# EAGLE design Sequencer1 (EAGLE 9.6.2)
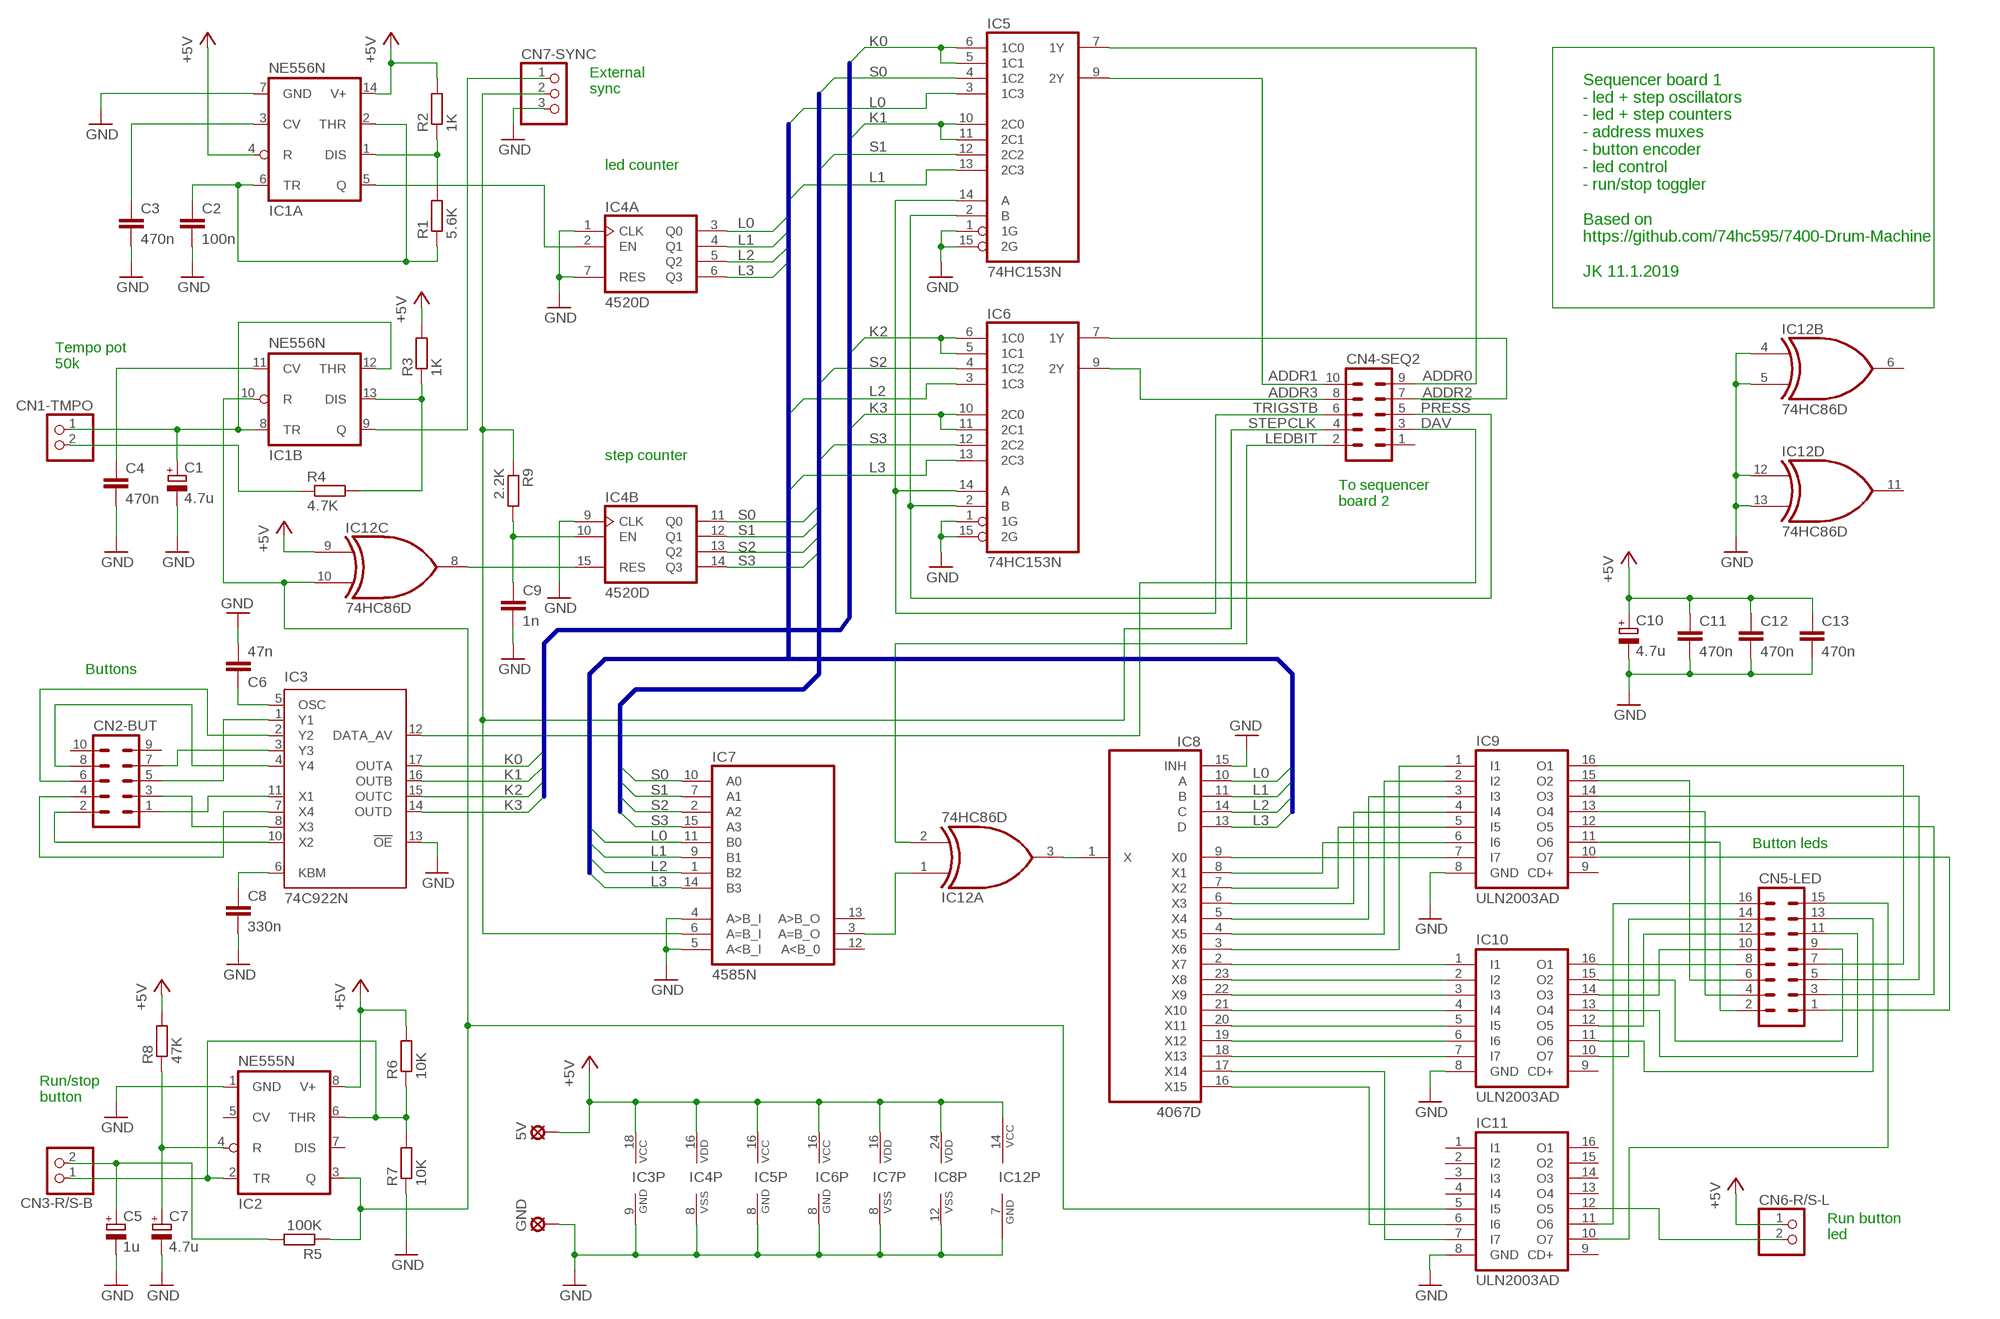
[diagram p0: schematic, sheet 1]

## Parts
5V  LSP10  [LSP10]
C1  4.7u  CPOL-EUSMCA  [SMC_A]
C2  100n  C-EUC0805  [C0805]
C3  470n  C-EUC0603  [C0603]
C4  470n  C-EUC0603  [C0603]
C5  1u  CPOL-EUSMCA  [SMC_A]
C6  47n  C-EUC0805  [C0805]
C7  4.7u  CPOL-EUSMCA  [SMC_A]
C8  330n  C-EUC0805  [C0805]
C9  1n  C-EUC0805  [C0805]
C10  4.7u  CPOL-EUSMCA  [SMC_A]
C11  470n  C-EUC0603  [C0603]
C12  470n  C-EUC0603  [C0603]
C13  470n  C-EUC0603  [C0603]
CN1-TMPO  PINHD-1X2  [1X02]
CN2-BUT  MA05-2  [MA05-2]
CN3-R/S-B  PINHD-1X2  [1X02]
CN4-SEQ2  MA05-2  [MA05-2]
CN5-LED  MA08-2  [MA08-2]
CN6-R/S-L  PINHD-1X2  [1X02]
CN7-SYNC  PINHD-1X3  [1X03]
GND  LSP10  [LSP10]
IC1  NE556N  [DIL14]
IC2  NE555N  [DIL08]
IC3  74C922N  [DIL18]
IC4  4520D  [SO16]
IC5  74HC153N  74AC153N  [DIL16]
IC6  74HC153N  74AC153N  [DIL16]
IC7  4585N  [DIL16]
IC8  4067D  [SO24W]
IC9  ULN2003AD  [SO16]
IC10  ULN2003AD  [SO16]
IC11  ULN2003AD  [SO16]
IC12  74HC86D  74LS86D  [SO14]
R1  5.6K  R-EU_R0805  [R0805]
R2  1K  R-EU_R0805  [R0805]
R3  1K  R-EU_R0805  [R0805]
R4  4.7K  R-EU_R0805  [R0805]
R5  100K  R-EU_R0805  [R0805]
R6  10K  R-EU_R0805  [R0805]
R7  10K  R-EU_R0805  [R0805]
R8  47K  R-EU_R0805  [R0805]
R9  2.2K  R-EU_R0805  [R0805]

## Nets
!PRESS: CN4-SEQ2.5 IC5.2(B) IC6.2(B)
!RUN: IC4.15(B:RES) IC12.8(C:O)
+5V: 5V.MP C10.+ C11.1 C12.1 C13.1 CN6-R/S-L.1 IC1.4(A:R) IC1.14(A:V+) IC2.8(V+) IC3.18(VCC) IC4.16(P:VDD) IC5.16(VCC) IC6.16(VCC) IC7.16(VDD) IC8.24(VDD) IC12.9(C:I0) IC12.14(P:VCC) R2.2 R3.2 R6.2 R8.2
ADDR0: CN4-SEQ2.9 IC5.7(1Y)
ADDR1: CN4-SEQ2.10 IC5.9(2Y)
ADDR2: CN4-SEQ2.7 IC6.7(1Y)
ADDR3: CN4-SEQ2.8 IC6.9(2Y)
DAV: CN4-SEQ2.3 IC3.12(DATA_AV)
GND: C1.- C2.2 C3.2 C4.2 C5.- C6.2 C7.- C8.2 C9.2 C10.- C11.2 C12.2 C13.2 CN7-SYNC.3 GND.MP IC1.7(A:GND) IC2.1(GND) IC3.9(GND) IC3.13(!OE) IC4.1(A:CLK) IC4.7(A:RES) IC4.8(P:VSS) IC4.9(B:CLK) IC5.1(1G) IC5.8(GND) IC5.15(2G) IC6.1(1G) IC6.8(GND) IC6.15(2G) IC7.4(A>B_I) IC7.5(A<B_I) IC7.8(VSS) IC8.12(VSS) IC8.15(INH) IC9.8(GND) IC10.8(GND) IC11.8(GND) IC12.4(B:I0) IC12.5(B:I1) IC12.7(P:GND) IC12.12(D:I0) IC12.13(D:I1) R7.1
K0: IC3.17(OUTA) IC5.5(1C1) IC5.6(1C0)
K1: IC3.16(OUTB) IC5.10(2C0) IC5.11(2C1)
K2: IC3.15(OUTC) IC6.5(1C1) IC6.6(1C0)
K3: IC3.14(OUTD) IC6.10(2C0) IC6.11(2C1)
L0: IC4.3(A:Q0) IC5.3(1C3) IC7.11(B0) IC8.10(A)
L1: IC4.4(A:Q1) IC5.13(2C3) IC7.9(B1) IC8.11(B)
L2: IC4.5(A:Q2) IC6.3(1C3) IC7.1(B2) IC8.14(C)
L3: IC4.6(A:Q3) IC6.13(2C3) IC7.14(B3) IC8.13(D)
LED0: CN5-LED.1 IC9.10(O7)
LED1: CN5-LED.2 IC9.11(O6)
LED2: CN5-LED.3 IC9.12(O5)
LED3: CN5-LED.4 IC9.13(O4)
LED4: CN5-LED.5 IC9.14(O3)
LED5: CN5-LED.6 IC9.15(O2)
LED6: CN5-LED.7 IC9.16(O1)
LED7: CN5-LED.8 IC10.16(O1)
LED8: CN5-LED.9 IC10.15(O2)
LED9: CN5-LED.10 IC10.14(O3)
LED10: CN5-LED.11 IC10.13(O4)
LED11: CN5-LED.12 IC10.12(O5)
LED12: CN5-LED.13 IC10.11(O6)
LED13: CN5-LED.14 IC10.10(O7)
LED14: CN5-LED.15 IC11.10(O7)
LED15: CN5-LED.16 IC11.11(O6)
LEDBIT: CN4-SEQ2.2 IC12.2(A:I1)
LEDCLK: IC1.5(A:Q) IC4.2(A:EN)
N$1: C3.1 IC1.3(A:CV)
N$2: C2.1 IC1.2(A:THR) IC1.6(A:TR) R1.1
N$3: C1.+ CN1-TMPO.1 IC1.8(B:TR) IC1.12(B:THR)
N$4: IC1.1(A:DIS) R1.2 R2.1
N$5: C4.1 IC1.11(B:CV)
N$6: CN1-TMPO.2 R4.1
N$7: IC1.13(B:DIS) R3.1 R4.2
N$8: CN3-R/S-B.1 IC2.2(TR) IC2.6(THR) R6.1 R7.2
N$9: C8.1 IC3.6(KBM)
N$10: C6.1 IC3.5(OSC)
N$11: C5.+ CN3-R/S-B.2 R5.2
N$12: IC8.9(X0) IC9.7(I7)
N$14: IC8.7(X2) IC9.5(I5)
N$15: C7.+ IC2.4(R) R8.1
N$16: IC8.6(X3) IC9.4(I4)
N$17: IC8.5(X4) IC9.3(I3)
N$18: IC8.4(X5) IC9.2(I2)
N$19: C9.1 IC4.10(B:EN) R9.2
N$20: IC8.3(X6) IC9.1(I1)
N$21: IC8.2(X7) IC10.1(I1)
N$22: IC8.23(X8) IC10.2(I2)
N$23: IC8.22(X9) IC10.3(I3)
N$24: IC8.21(X10) IC10.4(I4)
N$25: IC8.20(X11) IC10.5(I5)
N$26: IC8.19(X12) IC10.6(I6)
N$27: IC8.18(X13) IC10.7(I7)
N$28: IC8.17(X14) IC11.7(I7)
N$29: IC8.16(X15) IC11.6(I6)
N$30: IC8.1(X) IC12.3(A:O)
N$31: IC7.3(A=B_O) IC12.1(A:I0)
N$32: IC8.8(X1) IC9.6(I6)
RUN: IC1.10(B:R) IC2.3(Q) IC11.5(I5) IC12.10(C:I1) R5.1
RUNLED: CN6-R/S-L.2 IC11.12(O5)
S0: IC4.11(B:Q0) IC5.4(1C2) IC7.10(A0)
S1: IC4.12(B:Q1) IC5.12(2C2) IC7.7(A1)
S2: IC4.13(B:Q2) IC6.4(1C2) IC7.2(A2)
S3: IC4.14(B:Q3) IC6.12(2C2) IC7.15(A3)
STEPCLK: CN4-SEQ2.4 CN7-SYNC.2 IC7.6(A=B_I) R9.1
STEPCLK_OUT: CN7-SYNC.1 IC1.9(B:Q)
TRIGSTB: CN4-SEQ2.6 IC5.14(A) IC6.14(A)
X1: CN2-BUT.1 IC3.11(X1)
X2: CN2-BUT.2 IC3.10(X2)
X3: CN2-BUT.3 IC3.8(X3)
X4: CN2-BUT.4 IC3.7(X4)
Y1: CN2-BUT.5 IC3.1(Y1)
Y2: CN2-BUT.6 IC3.2(Y2)
Y3: CN2-BUT.7 IC3.3(Y3)
Y4: CN2-BUT.8 IC3.4(Y4)
Unconnected: CN2-BUT.9 CN2-BUT.10 CN4-SEQ2.1 IC2.5(CV) IC2.7(DIS) IC7.12(A<B_0) IC7.13(A>B_O) IC9.9(CD+) IC10.9(CD+) IC11.1(I1) IC11.2(I2) IC11.3(I3) IC11.4(I4) IC11.9(CD+) IC11.13(O4) IC11.14(O3) IC11.15(O2) IC11.16(O1) IC12.6(B:O) IC12.11(D:O)

## Buses
B$1
B$2
B$3

## Notes on the sheet
- External
  sync
- led counter
- Sequencer board 1
  - led + step oscillators
  - led + step counters
  - address muxes
  - button encoder
  - led control
  - run/stop toggler
  
  Based on
  https://github.com/74hc595/7400-Drum-Machine
  
  JK 11.1.2019
- Tempo pot
  50k
- step counter
- To sequencer
  board 2
- Buttons
- Button leds
- Run/stop
  button
- Run button
  led

## Library data of the parts
5V GND = solpad:LSP10: SOLDER PAD drill 1.0 mm, distributor Buerklin, 12H555
C1 C5 C7 C10 = rcl:CPOL-EU: POLARIZED CAPACITOR, European symbol
C2-C4 C6 C8 C9 C11-C13 = rcl:C-EU: CAPACITOR, European symbol
CN1-TMPO CN3-R/S-B CN6-R/S-L = pinhead:PINHD-1X2: PIN HEADER
CN2-BUT CN4-SEQ2 = con-lstb:MA05-2: PIN HEADER; OC_FARNELL: unknown; OC_NEWARK: unknown
CN5-LED = con-lstb:MA08-2: PIN HEADER; OC_FARNELL: unknown; OC_NEWARK: unknown
CN7-SYNC = pinhead:PINHD-1X3: PIN HEADER
IC1 = linear:*556: Dual TIMER
IC2 = linear:*555: TIMER
IC3 = 74xx-eu:74C922: 16-Key Encoder Source: http://www.national.com/ds/MM/MM54C922.pdf#page=1
IC4 = 45xx:4520: Dual binary up COUNTER
IC5 IC6 = 74xx-eu:74*153: Dual 4-line to 1-line data SELECTOR/MULTIPLEXER
IC7 = 45xx:4585: 4-bit COMPARATOR (MC14585BCP)
IC8 = 40xx:4067: 16-channel ANALOG MULTIPLEXER
IC9-IC11 = uln-udn:ULN2003A: DRIVER ARRAY
IC12 = 74xx-us:74*86: Quad 2-input EXCLUSIV-OR (XOR) gate
R1-R9 = rcl:R-EU_: RESISTOR, European symbol

## Board
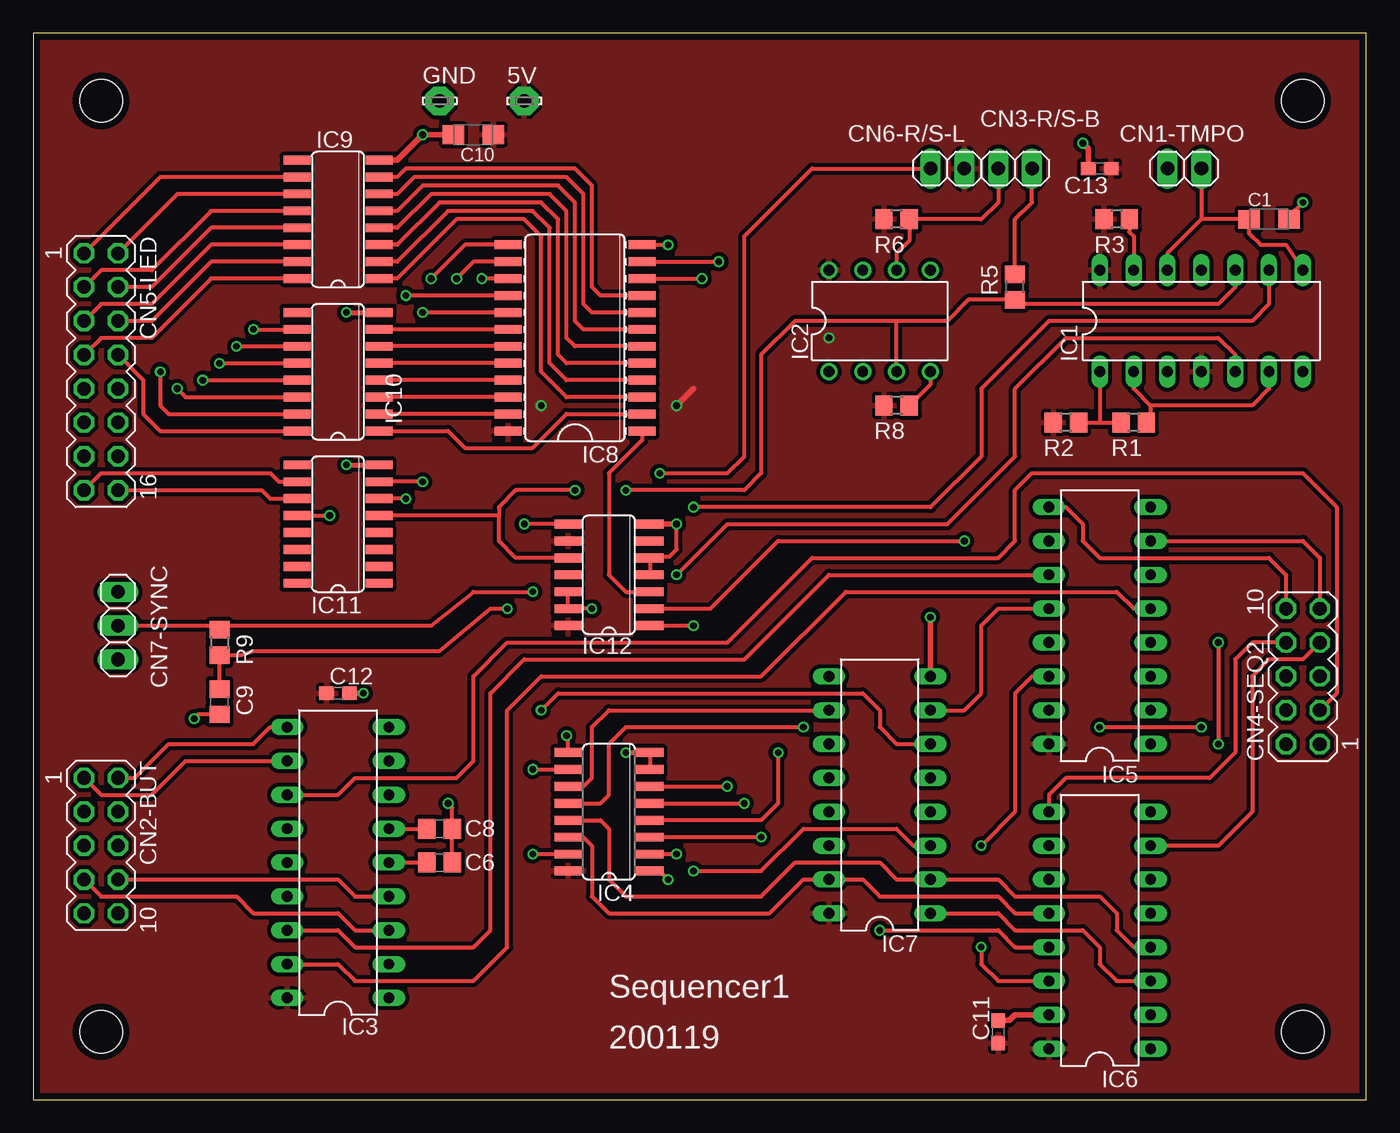
[diagram p1: board, top side]
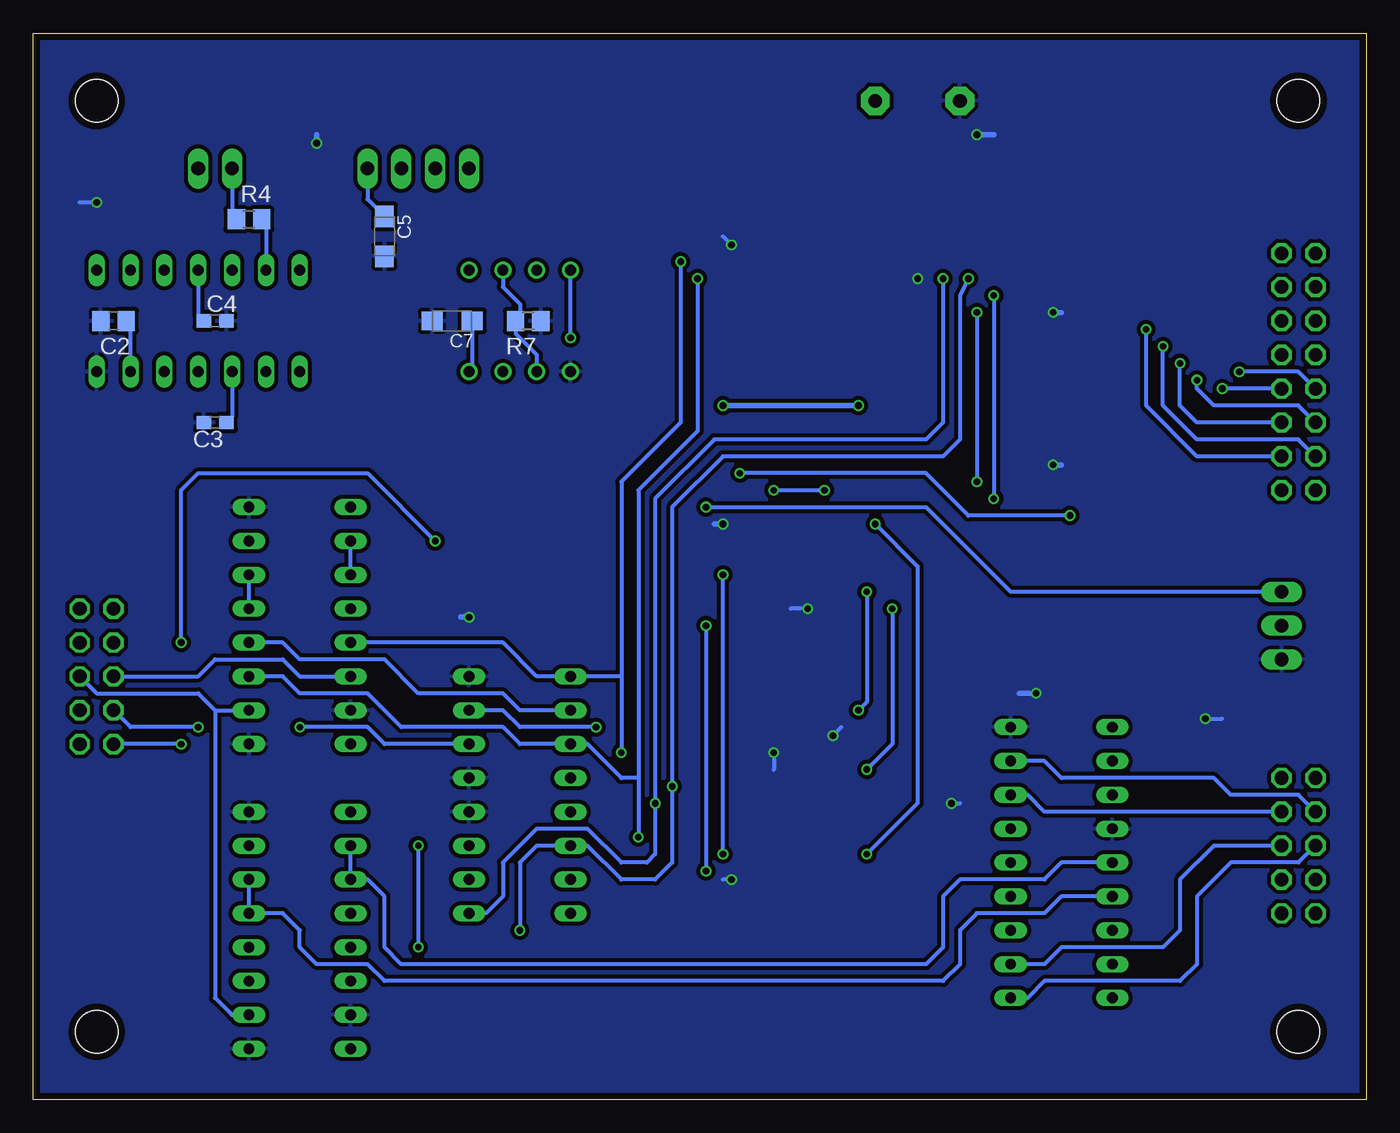
[diagram p2: board, bottom side, seen from below]

Size 100 x 80 mm. Coordinates in mm from the lower left corner, seen from the top.
Outline: 0,0 100,0 100,80 0,80 0,0
Copper layers (1*16): Top 0.035mm / dielectric 1.6mm / Bottom 0.035mm
Design rules "Elecrow_2-layer_PCB_eagle_rule": minimum track width 6mil, minimum drill 12mil, track to track 6mil, track to pad 6mil, pad to pad 6mil, via to via 8mil, smd to smd 0mil, copper to edge 20mil, drill to drill 10mil, minimum pad ring 6mil, minimum via ring 6mil, stop-mask expansion 0mil, vias tented up to drill 100mil, thermal gap 10mil
Holes 3.2 mm at 5.08,5.08 95.25,5.08 5.08,74.93 95.25,74.93

### Footprints (pad centres in the part's own frame; a part is rotated, then mirrored left to right if it is on the bottom)
LSP10 = drill 1.016 pad 2.159 octagon: MP 0,0
SMC_A = smd 1.6 x 1.4: + -1.5,0; - 1.5,0
C0805 = smd 1.3 x 1.5: 1 -0.95,0; 2 0.95,0
C0603 = smd 1.1 x 1: 1 -0.85,0; 2 0.85,0
1X02 = drill 1.016 long: 1 -1.27,0; 2 1.27,0
MA05-2 = drill 1.016 octagon: 1 -5.08,-1.27; 2 -5.08,1.27; 3 -2.54,-1.27; 4 -2.54,1.27; 5 0,-1.27; 6 0,1.27; 7 2.54,-1.27; 8 2.54,1.27; 9 5.08,-1.27; 10 5.08,1.27
MA08-2 = drill 1.016 octagon: 1 -8.89,-1.27; 2 -8.89,1.27; 3 -6.35,-1.27; 4 -6.35,1.27; 5 -3.81,-1.27; 6 -3.81,1.27; 7 -1.27,-1.27; 8 -1.27,1.27; 9 1.27,-1.27; 10 1.27,1.27; 11 3.81,-1.27; 12 3.81,1.27; 13 6.35,-1.27; 14 6.35,1.27; 15 8.89,-1.27; 16 8.89,1.27
1X03 = drill 1.016 long: 1 -2.54,0; 2 0,0; 3 2.54,0
DIL14 = drill 0.813 long: 1 -7.62,-3.81; 2 -5.08,-3.81; 3 -2.54,-3.81; 4 0,-3.81; 5 2.54,-3.81; 6 5.08,-3.81; 7 7.62,-3.81; 8 7.62,3.81; 9 5.08,3.81; 10 2.54,3.81; 11 0,3.81; 12 -2.54,3.81; 13 -5.08,3.81; 14 -7.62,3.81
DIL08 = drill 0.813 pad 1.27: 1 -3.81,-3.81; 2 -1.27,-3.81; 3 1.27,-3.81; 4 3.81,-3.81; 5 3.81,3.81; 6 1.27,3.81; 7 -1.27,3.81; 8 -3.81,3.81
DIL18 = drill 0.813 long: 1 -10.16,-3.81; 2 -7.62,-3.81; 3 -5.08,-3.81; 4 -2.54,-3.81; 5 0,-3.81; 6 2.54,-3.81; 7 5.08,-3.81; 8 7.62,-3.81; 9 10.16,-3.81; 10 10.16,3.81; 11 7.62,3.81; 12 5.08,3.81; 13 2.54,3.81; 14 0,3.81; 15 -2.54,3.81; 16 -5.08,3.81; 17 -7.62,3.81; 18 -10.16,3.81
SO16 = smd 0.66 x 2.032: 1 -4.445,-3.073; 2 -3.175,-3.073; 3 -1.905,-3.073; 4 -0.635,-3.073; 5 0.635,-3.073; 6 1.905,-3.073; 7 3.175,-3.073; 8 4.445,-3.073; 9 4.445,3.073; 10 3.175,3.073; 11 1.905,3.073; 12 0.635,3.073; 13 -0.635,3.073; 14 -1.905,3.073; 15 -3.175,3.073; 16 -4.445,3.073
DIL16 = drill 0.813 long: 1 -8.89,-3.81; 2 -6.35,-3.81; 3 -3.81,-3.81; 4 -1.27,-3.81; 5 1.27,-3.81; 6 3.81,-3.81; 7 6.35,-3.81; 8 8.89,-3.81; 9 8.89,3.81; 10 6.35,3.81; 11 3.81,3.81; 12 1.27,3.81; 13 -1.27,3.81; 14 -3.81,3.81; 15 -6.35,3.81; 16 -8.89,3.81
SO24W = smd 0.66 x 2.032: 1 -6.985,-5.029; 2 -5.715,-5.029; 3 -4.445,-5.029; 4 -3.175,-5.029; 5 -1.905,-5.029; 6 -0.635,-5.029; 7 0.635,-5.029; 8 1.905,-5.029; 9 3.175,-5.029; 10 4.445,-5.029; 11 5.715,-5.029; 12 6.985,-5.029; 13 6.985,5.029; 14 5.715,5.029; 15 4.445,5.029; 16 3.175,5.029; 17 1.905,5.029; 18 0.635,5.029; 19 -0.635,5.029; 20 -1.905,5.029; 21 -3.175,5.029; 22 -4.445,5.029; 23 -5.715,5.029; 24 -6.985,5.029
SO14 = smd 0.66 x 2.032: 1 -3.81,-3.073; 2 -2.54,-3.073; 3 -1.27,-3.073; 4 0,-3.073; 5 1.27,-3.073; 6 2.54,-3.073; 7 3.81,-3.073; 8 3.81,3.073; 9 2.54,3.073; 10 1.27,3.073; 11 0,3.073; 12 -1.27,3.073; 13 -2.54,3.073; 14 -3.81,3.073
R0805 = smd 1.3 x 1.5: 1 -0.95,0; 2 0.95,0

### Placement (x,y rotation side)
5V  36.83,74.93 0 top
C1  92.71,66.04 0 top
C2  93.98,58.42 180 bottom
C3  86.36,50.8 180 bottom
C4  86.36,58.42 0 bottom
C5  73.66,64.77 270 bottom
C6  30.48,17.78 0 top
C7  68.58,58.42 180 bottom
C8  30.48,20.32 0 top
C9  13.97,29.84 270 top
C10  33.02,72.39 180 top
C11  72.39,5.08 90 top
C12  22.86,30.48 0 top
C13  80.01,69.85 180 top
CN1-TMPO  86.36,69.85 180 top
CN2-BUT  5.08,19.05 270 top
CN3-R/S-B  73.66,69.85 0 top
CN4-SEQ2  95.25,31.75 90 top
CN5-LED  5.08,54.61 270 top
CN6-R/S-L  68.58,69.85 180 top
CN7-SYNC  6.35,35.56 270 top
GND  30.48,74.93 0 top
IC1  87.63,58.42 0 top
IC2  63.5,58.42 0 top
IC3  22.86,17.78 90 top
IC4  43.18,21.59 90 top
IC5  80.01,35.56 90 top
IC6  80.01,12.7 90 top
IC7  63.5,22.86 90 top
IC8  40.64,57.15 90 top
IC9  22.86,66.04 90 top
IC10  22.86,54.61 90 top
IC11  22.86,43.18 90 top
IC12  43.18,39.37 90 top
R1  82.55,50.8 180 top
R2  77.47,50.8 180 top
R3  81.28,66.04 180 top
R4  83.82,66.04 0 bottom
R5  73.66,60.96 90 top
R6  64.77,66.04 180 top
R7  62.87,58.42 180 bottom
R8  64.77,52.07 180 top
R9  13.97,34.29 270 top

### Tracks (layer width: path | path; a pad name or v marks a point on that pad's centre or on a via)
!PRESS
  Bottom 0.305: CN4-SEQ2.5 95.25,30.48 87.63,30.48 86.36,29.21 | 86.36,29.21 IC5.2 | 86.36,29.21 86.36,7.62 85.09,6.35 IC6.2
!RUN  (via drill 0.5)
  Top 0.305: IC12.8 v36.83,43.18 | v37.47,18.41 IC4.15
  Bottom 0.305: v36.83,43.18 33.66,40.01 33.66,22.23 v37.47,18.41
+5V  (via drill 0.5)
  Top 0.305: R8.2 63.82,52.38
  Top 0.406: v48.26,52.07 49.53,53.34
  Bottom 0.305: v59.69,57.15 IC2.8
  Bottom 0.406: v38.1,52.07 v48.26,52.07
  pour Top (isolate 0.305): -2.54,82.55 102.87,82.55 102.87,-2.54 -2.54,-2.54
ADDR0
  Top 0.305: IC5.7 95.25,41.91 96.52,40.64 CN4-SEQ2.9
ADDR1
  Top 0.305: IC5.9 77.47,44.45 78.74,43.18 78.74,41.91 80.01,40.64 92.71,40.64 93.98,39.37 CN4-SEQ2.10
ADDR2
  Top 0.305: CN4-SEQ2.7 95.25,33.02 92.71,33.02 91.44,31.75 91.44,21.59 88.9,19.05 IC6.7
ADDR3
  Top 0.305: CN4-SEQ2.8 91.44,34.29 90.17,33.02 90.17,26.04 88.27,24.13 77.47,24.13 76.2,22.86 IC6.9
DAV
  Top 0.305: IC3.12 22.86,22.86 24.13,24.13 31.75,24.13 33.02,25.4 33.02,31.75 35.56,34.29 52.07,34.29 58.42,40.64 72.39,40.64 73.66,41.91 73.66,45.72 74.93,46.99 95.25,46.99 97.79,44.45 97.79,30.48 CN4-SEQ2.3
GND  (via drill 0.5)
  Top 0.305: IC12.4 IC12.5 46.35,40.74 47.73,40.74 48.26,41.27 v48.26,43.18 | IC12.12 IC12.13 v41.91,36.83 | IC4.9 40.11,27.2 v40.01,27.3 | 46.25,25.93 IC4.7 | IC4.1 46.99,17.14 v47.62,16.51 | C6.2 C8.2 31.43,21.91 v31.11,22.23 | C9.2 12.38,28.89 v12.06,28.57 | C1.- 94.21,66.27 v95.25,67.31 | IC8.12 v47.62,64.14 | IC8.15 v33.66,61.59
  Top 0.406: C10.- v29.21,72.39 27.3,70.48 IC9.8 | IC10.8 25.93,58.95 v23.5,59.05 | IC11.8 25.93,47.52 v23.5,47.62 | IC12.7 v48.26,43.18 | IC4.8 46.25,25.93 v44.45,26.04 | IC7.8 v67.31,36.2 | C12.2 v24.77,30.48 | C13.2 79.16,71.33 v78.74,71.75 | C11.2 73.24,5.93 73.66,6.35 IC6.15
  Bottom 0.305: v41.91,36.83 43.18,36.83 | v40.01,27.3 39.37,27.94 | v44.45,26.04 44.45,24.77 | v47.62,16.51 48.26,16.51 | v31.11,22.23 30.48,22.23 | v12.06,28.57 10.79,28.57 | v95.25,67.31 96.52,67.31 | v47.62,64.14 48.26,64.77
  Bottom 0.406: v29.21,72.39 27.94,72.39 | v23.5,59.05 22.86,59.05 | v23.5,47.62 22.86,47.62 | v48.26,43.18 48.9,43.18 | v67.31,36.2 67.94,36.2 | v24.77,30.48 26.04,30.48 | v78.74,71.75 78.74,72.39
  pour Bottom (isolate 0.305): -1.27,81.28 101.6,81.28 101.6,-1.27 -1.27,-1.27
K0
  Top 0.305: IC3.17 22.86,10.16 24.13,8.89 33.02,8.89 35.56,11.43 35.56,29.21 38.1,31.75 54.61,31.75 60.96,38.1 81.28,38.1 82.55,36.83 IC5.5
  Bottom 0.305: IC5.5 IC5.6
K1
  Top 0.305: IC3.16 22.86,12.7 24.13,11.43 33.02,11.43 34.29,12.7 34.29,30.48 36.83,33.02 53.34,33.02 59.69,39.37 IC5.11
  Bottom 0.305: IC5.11 IC5.10
K2
  Bottom 0.305: IC3.15 22.86,15.24 24.13,13.97 29.21,13.97 30.48,12.7 30.48,10.16 31.75,8.89 73.66,8.89 74.93,10.16 78.74,10.16 80.01,11.43 80.01,12.7 81.28,13.97 IC6.5 IC6.6
K3
  Bottom 0.305: IC3.14 22.86,17.78 24.13,16.51 30.48,16.51 31.75,15.24 31.75,11.43 33.02,10.16 72.39,10.16 73.66,11.43 73.66,15.24 74.93,16.51 IC6.11 IC6.10
L0  (via drill 0.5)
  Top 0.305: IC8.10 v50.16,61.59 | v54.61,19.68 IC4.3
  Bottom 0.305: v50.16,61.59 50.16,50.16 54.61,45.72 54.61,24.13 | 54.61,24.13 55.88,24.13 58.42,26.67 IC7.11 63.5,26.67 64.77,27.94 72.39,27.94 74.93,30.48 80.01,30.48 81.28,31.75 IC5.3 | 54.61,24.13 v54.61,19.68
L1  (via drill 0.5)
  Top 0.305: IC8.11 v51.44,62.87 | v55.88,26.04 55.88,22.23 54.61,20.95 IC4.4
  Bottom 0.305: v51.44,62.87 51.44,50.8 55.88,46.35 55.88,31.75 | 55.88,31.75 IC7.9 62.23,31.75 64.77,34.29 IC5.13 | 55.88,31.75 v55.88,26.04
L2  (via drill 0.5)
  Top 0.305: IC8.14 33.02,62.87 v31.75,61.59 | IC4.5 v53.34,22.23 | IC7.1 72.39,13.97 73.66,12.7 78.74,12.7 80.01,11.43 80.01,10.16 81.28,8.89 IC6.3
  Bottom 0.305: v31.75,61.59 31.75,50.8 33.02,49.53 48.9,49.53 53.34,45.09 v53.34,22.23 53.34,18.41 53.98,17.78 55.88,17.78 58.42,20.32 62.23,20.32 64.77,17.78 64.77,15.24 66.04,13.97 IC7.1
L3  (via drill 0.5)
  Top 0.305: IC8.13 32.38,64.14 v29.84,61.59 | v63.5,12.7 72.39,12.7 73.66,11.43 IC6.13 | IC4.6 v52.07,23.5
  Bottom 0.305: v29.84,61.59 30.48,60.33 30.48,49.53 31.75,48.26 48.26,48.26 52.07,44.45 v52.07,23.5 52.07,17.78 53.34,16.51 55.88,16.51 58.42,19.05 IC7.14 62.23,19.05 63.5,17.78 v63.5,12.7
LED0
  Top 0.305: IC9.10 9.53,69.22 CN5-LED.1
LED1
  Top 0.305: IC9.11 10.79,67.94 CN5-LED.2
LED2
  Top 0.305: IC9.12 13.34,66.67 8.89,62.23 5.08,62.23 CN5-LED.3
LED3
  Top 0.305: IC9.13 13.34,65.41 8.89,60.96 CN5-LED.4
LED4
  Top 0.305: IC9.14 13.34,64.14 8.89,59.69 5.08,59.69 CN5-LED.5
LED5
  Top 0.305: IC9.15 13.34,62.87 8.89,58.42 CN5-LED.6
LED6
  Top 0.305: IC9.16 13.34,61.59 8.89,57.15 5.08,57.15 CN5-LED.7
LED7
  Top 0.305: CN5-LED.8 8.26,53.98 8.26,51.44 9.53,50.16 IC10.16
LED8  (via drill 0.5)
  Top 0.305: v9.53,54.61 9.53,52.07 10.16,51.44 IC10.15
  Bottom 0.305: CN5-LED.9 5.08,54.61 v9.53,54.61
LED9  (via drill 0.5)
  Top 0.305: v10.79,53.34 11.43,52.7 IC10.14
  Bottom 0.305: CN5-LED.10 v10.79,53.34
LED10  (via drill 0.5)
  Top 0.305: v12.7,53.98 IC10.13
  Bottom 0.305: CN5-LED.11 5.08,52.07 11.43,52.07 12.7,53.34 v12.7,53.98
LED11  (via drill 0.5)
  Top 0.305: v13.97,55.24 IC10.12
  Bottom 0.305: CN5-LED.12 12.7,50.8 13.97,52.07 v13.97,55.24
LED12  (via drill 0.5)
  Top 0.305: v15.24,56.52 IC10.11
  Bottom 0.305: CN5-LED.13 5.08,49.53 12.7,49.53 15.24,52.07 v15.24,56.52
LED13  (via drill 0.5)
  Top 0.305: v16.51,57.78 IC10.10
  Bottom 0.305: CN5-LED.14 12.7,48.26 16.51,52.07 v16.51,57.78
LED14
  Top 0.305: CN5-LED.15 5.08,46.99 17.78,46.99 18.41,46.35 IC11.10
LED15
  Top 0.305: CN5-LED.16 17.14,45.72 17.78,45.09 IC11.11
LEDBIT  (via drill 0.5)
  Top 0.305: IC12.2 50.8,36.83 55.88,41.91 v69.85,41.91 | v88.9,34.29 v88.9,26.67
  Bottom 0.305: v88.9,26.67 CN4-SEQ2.2 | v88.9,34.29 88.9,45.72 87.63,46.99 74.93,46.99 v69.85,41.91
LEDCLK  (via drill 0.5)
  Top 0.305: IC4.2 v48.26,18.41 | v48.26,39.37 52.07,43.18 68.58,43.18 73.66,48.26 73.66,53.34 77.47,57.15 88.9,57.15 90.17,55.88 IC1.5
  Bottom 0.305: v48.26,18.41 v48.26,39.37
N$1
  Bottom 0.305: IC1.3 85.09,51.22 C3.1
N$2
  Top 0.305: IC1.2 82.55,53.34 83.82,52.07 | 83.82,52.07 83.82,51.12 R1.1 | IC1.6 92.71,53.34 91.44,52.07 83.82,52.07
  Bottom 0.305: IC1.6 92.71,58.1 C2.1
N$3
  Top 0.305: CN1-TMPO.1 87.63,66.04 | 87.63,66.04 85.09,63.5 IC1.12 | 87.63,66.04 C1.+ 91.21,65 92.08,64.14 93.98,64.14 IC1.8
N$4
  Top 0.305: IC1.1 80.01,50.8 | R2.1 80.01,50.8 | 80.01,50.8 R1.2
N$5
  Bottom 0.305: IC1.11 87.63,58.84 C4.1
N$6
  Bottom 0.305: CN1-TMPO.2 85.09,66.36 R4.1
N$7
  Top 0.305: R3.1 82.23,65.09 82.55,64.77 IC1.13
  Bottom 0.305: R4.2 82.55,66.04 IC1.13
N$8
  Top 0.305: CN3-R/S-B.1 72.39,67.31 71.12,66.04 R6.1 65.72,64.45 64.77,63.5 IC2.6
  Bottom 0.305: IC2.6 64.77,60.96 63.5,59.69 63.5,58.74 R7.2 63.81,57.47 62.23,55.88 IC2.2
N$9
  Top 0.305: IC3.6 C8.1
N$10
  Top 0.305: IC3.5 C6.1
N$11
  Top 0.305: R5.2 73.66,66.04 74.93,67.31 CN3-R/S-B.2
  Bottom 0.305: CN3-R/S-B.2 74.93,67.54 C5.+
N$12
  Top 0.305: IC8.9 42.55,60.33 41.91,60.96 41.91,68.58 40.64,69.85 27.94,69.85 27.3,69.22 IC9.7
N$14
  Top 0.305: IC8.7 41.27,57.78 40.64,58.42 40.64,67.31 39.37,68.58 29.21,68.58 27.3,66.67 IC9.5
N$15
  Top 0.305: IC2.4 67.31,53.66 R8.1
  Bottom 0.305: C7.+ 67.08,54.84 IC2.4
N$16
  Top 0.305: IC8.6 40.64,56.52 40.01,57.15 40.01,66.67 38.73,67.94 29.84,67.94 27.3,65.41 IC9.4
N$17
  Top 0.305: IC8.5 40.01,55.24 39.37,55.88 39.37,66.04 38.1,67.31 30.48,67.31 27.3,64.14 IC9.3
N$18
  Top 0.305: IC8.4 40.01,53.98 38.73,55.24 38.73,65.41 37.47,66.67 31.11,66.67 27.3,62.87 IC9.2
N$19  (via drill 0.5)
  Top 0.305: v35.56,36.83 34.29,36.83 30.48,33.66 16.51,33.66 15.56,33.34 R9.2 C9.1 | v37.47,24.77 IC4.10
  Bottom 0.305: v35.56,36.83 35.56,26.67 v37.47,24.77
N$20
  Top 0.305: IC8.3 40.01,52.7 38.1,54.61 38.1,64.77 36.83,66.04 31.75,66.04 27.3,61.59 IC9.1
N$21
  Top 0.305: IC10.1 31.11,50.16 32.38,48.9 37.47,48.9 40.01,51.44 IC8.2
N$22
  Top 0.305: IC8.23 IC10.2
N$23
  Top 0.305: IC8.22 IC10.3
N$24
  Top 0.305: IC8.21 IC10.4
N$25
  Top 0.305: IC8.20 IC10.5
N$26
  Top 0.305: IC8.19 IC10.6
N$27
  Top 0.305: IC8.18 IC10.7
N$28  (via drill 0.5)
  Top 0.305: IC8.17 v29.21,59.05 | v29.21,46.35 IC11.7
  Bottom 0.305: v29.21,59.05 v29.21,46.35
N$29  (via drill 0.5)
  Top 0.305: IC8.16 v27.94,60.33 | v27.94,45.09 IC11.6
  Bottom 0.305: v27.94,60.33 v27.94,45.09
N$30
  Top 0.305: IC8.1 45.67,49.48 43.18,46.99 43.18,39.37 44.45,38.1 IC12.3
N$31  (via drill 0.5)
  Top 0.305: IC12.1 v49.53,35.56 | v49.53,17.14 54.61,17.14 57.78,20.32 64.77,20.32 66.04,19.05 IC7.3
  Bottom 0.305: v49.53,35.56 v49.53,17.14
N$32
  Top 0.305: IC8.8 41.91,59.05 41.27,59.69 41.27,67.94 40.01,69.22 28.57,69.22 27.3,67.94 IC9.6
RUN  (via drill 0.5)
  Top 0.305: IC1.10 90.17,60.96 88.9,59.69 73.98,59.69 R5.1 70.17,60.01 68.58,58.42 64.77,58.42 | 64.77,58.42 57.15,58.42 54.61,55.88 54.61,46.99 53.34,45.72 v44.45,45.72 | 34.92,43.81 IC11.5 | IC12.10 36.2,40.64 34.92,41.91 34.92,43.81 | IC2.3 64.77,58.42 | v40.64,45.72 36.2,45.72 34.92,44.45 34.92,43.81
  Bottom 0.305: v44.45,45.72 v40.64,45.72
RUNLED  (via drill 0.5)
  Top 0.305: IC11.12 v22.23,43.81 | v46.99,46.99 52.07,46.99 53.34,48.26 53.34,64.77 58.42,69.85 CN6-R/S-L.2
  Bottom 0.305: v22.23,43.81 29.84,43.81 33.02,46.99 v46.99,46.99
S0
  Top 0.305: IC4.11 41.27,23.5 41.91,24.13 41.91,27.94 43.18,29.21 IC7.10
  Bottom 0.305: IC7.10 63.5,29.21 64.77,30.48 71.12,30.48 73.66,33.02 80.01,33.02 81.28,34.29 IC5.4
S1  (via drill 0.5)
  Top 0.305: IC4.12 42.55,22.23 43.18,22.86 43.18,26.67 44.45,27.94 v57.78,27.94 | IC7.7 69.85,29.21 71.12,30.48 71.12,35.56 72.39,36.83 IC5.12
  Bottom 0.305: v57.78,27.94 63.5,27.94 64.77,29.21 IC7.7
S2
  Top 0.305: IC4.13 42.55,20.95 43.18,20.32 43.18,16.51 44.45,15.24 54.61,15.24 57.15,17.78 63.5,17.78 64.77,16.51 IC7.2 72.39,16.51 73.66,15.24 80.01,15.24 81.28,13.97 81.28,12.7 82.55,11.43 IC6.4
S3
  Top 0.305: IC4.14 41.27,19.68 41.91,19.05 41.91,15.24 43.18,13.97 55.24,13.97 57.78,16.51 IC7.15 62.23,16.51 63.5,15.24 72.39,15.24 73.66,13.97 IC6.12
STEPCLK  (via drill 0.5)
  Top 0.305: v80.01,27.94 v87.63,27.94 | 13.97,35.56 13.65,35.24 R9.1 13.65,34.92 13.97,34.92 13.34,35.56 | 13.97,35.56 29.84,35.56 33.02,38.1 v37.47,38.1 | v38.1,29.21 39.37,30.48 62.23,30.48 63.5,29.21 63.5,27.94 64.77,26.67 IC7.6 | CN7-SYNC.2 13.97,35.56
  Bottom 0.305: IC7.6 73.66,26.67 74.93,27.94 v80.01,27.94 | v87.63,27.94 92.71,27.94 CN4-SEQ2.4 | v37.47,38.1 37.47,29.84 v38.1,29.21
STEPCLK_OUT  (via drill 0.5)
  Top 0.305: IC1.9 92.71,59.69 91.44,58.42 76.2,58.42 71.12,53.34 71.12,48.26 67.31,44.45 v49.53,44.45
  Bottom 0.305: v49.53,44.45 33.02,44.45 26.67,38.1 CN7-SYNC.1
TRIGSTB  (via drill 0.5)
  Top 0.305: IC5.14 74.93,31.75 73.66,30.48 73.66,21.59 v71.12,19.05 | v71.12,11.43 71.12,10.16 72.39,8.89 IC6.14
  Bottom 0.305: CN4-SEQ2.6 87.63,31.75 86.36,33.02 81.28,33.02 80.01,31.75 IC5.14 | v71.12,19.05 v71.12,11.43
X1
  Top 0.305: CN2-BUT.1 5.08,22.86 8.89,22.86 11.43,25.4 IC3.11
X2
  Top 0.305: CN2-BUT.2 7.62,24.13 10.16,26.67 16.51,26.67 17.78,27.94 IC3.10
X3
  Bottom 0.305: CN2-BUT.3 5.08,22.86 10.16,22.86 11.43,24.13 22.86,24.13 24.13,25.4 IC3.8
X4
  Bottom 0.305: CN2-BUT.4 24.13,21.59 25.4,22.86 IC3.7
Y1
  Bottom 0.305: CN2-BUT.5 5.08,17.78 10.16,17.78 12.7,15.24 12.7,10.16 13.97,8.89 24.13,8.89 25.4,7.62 IC3.1
Y2
  Bottom 0.305: CN2-BUT.6 11.43,19.05 13.97,16.51 13.97,12.7 15.24,11.43 22.86,11.43 24.13,10.16 IC3.2
Y3
  Top 0.305: CN2-BUT.7 5.08,15.24 15.24,15.24 16.51,13.97 22.86,13.97 24.13,12.7 IC3.3
Y4
  Top 0.305: CN2-BUT.8 22.86,16.51 24.13,15.24 IC3.4

### Text on the board
tNames: Sequencer1 | 200119